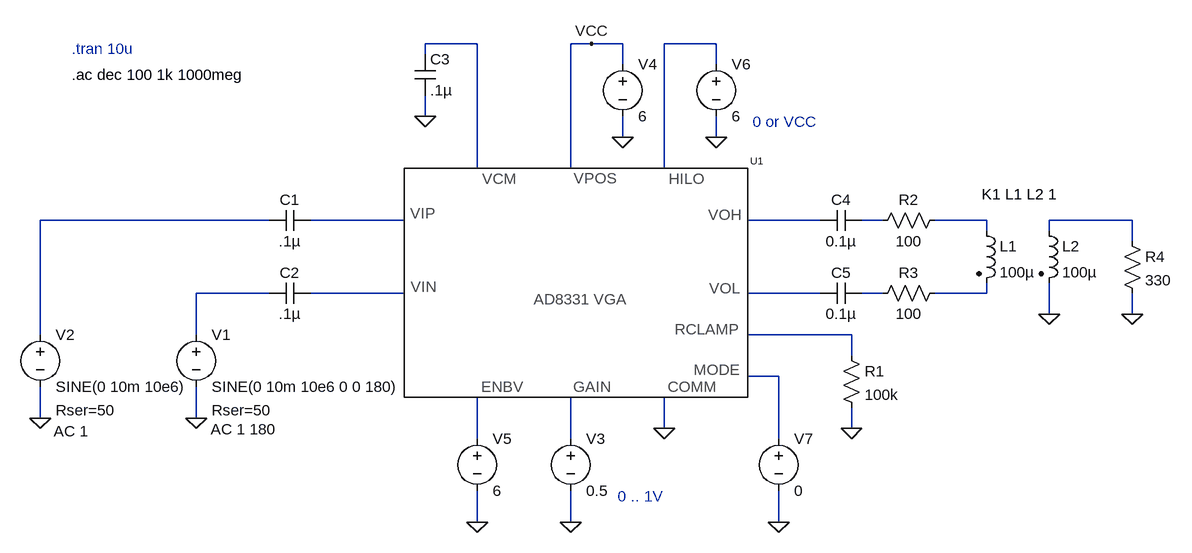
[diagram p0: schematic AD8331_VGA_test_ac.asc]
AD8331_VGA_test_ac.asc, the LTspice schematic file:
Version 4
SHEET 1 1140 680
WIRE 64 -176 -16 -176
WIRE 240 -176 208 -176
WIRE 288 -176 240 -176
WIRE 432 -176 352 -176
WIRE -16 -160 -16 -176
WIRE 288 -144 288 -176
WIRE 432 -144 432 -176
WIRE -16 -64 -16 -96
WIRE 288 -32 288 -64
WIRE 432 -32 432 -64
WIRE 64 16 64 -176
WIRE 208 16 208 -176
WIRE 352 16 352 -176
WIRE -256 96 -608 96
WIRE -48 96 -192 96
WIRE 592 96 480 96
WIRE 688 96 656 96
WIRE 848 96 768 96
WIRE 1072 96 944 96
WIRE 848 112 848 96
WIRE 944 112 944 96
WIRE 1072 128 1072 96
WIRE -256 208 -368 208
WIRE -48 208 -192 208
WIRE 592 208 480 208
WIRE 688 208 656 208
WIRE 848 208 848 192
WIRE 848 208 768 208
WIRE 944 240 944 192
WIRE 1072 240 1072 208
WIRE -608 272 -608 96
WIRE -368 272 -368 208
WIRE 640 272 480 272
WIRE 640 304 640 272
WIRE 528 336 480 336
WIRE -608 400 -608 352
WIRE -368 400 -368 352
WIRE 352 416 352 368
WIRE 640 416 640 384
WIRE 64 432 64 368
WIRE 208 432 208 368
WIRE 528 432 528 336
WIRE 64 560 64 512
WIRE 208 560 208 512
WIRE 528 560 528 512
FLAG -368 400 0
FLAG -608 400 0
FLAG 352 416 0
FLAG 208 560 0
FLAG 640 416 0
FLAG 288 -32 0
FLAG -16 -64 0
FLAG 944 240 0
FLAG 1072 240 0
FLAG 64 560 0
FLAG 528 560 0
FLAG 432 -32 0
FLAG 240 -176 VCC
SYMBOL cap -256 112 R270
WINDOW 0 32 32 VTop 0
WINDOW 3 0 32 VBottom 0
SYMATTR InstName C1
SYMATTR Value .1µ
SYMBOL cap -256 224 R270
WINDOW 0 32 32 VTop 0
WINDOW 3 0 32 VBottom 0
SYMATTR InstName C2
SYMATTR Value .1µ
SYMBOL voltage -368 256 R0
WINDOW 123 22 161 Left 0
WINDOW 39 24 132 Left 0
SYMATTR Value2 AC 1 180
SYMATTR SpiceLine Rser=50
SYMATTR InstName V1
SYMATTR Value SINE(0 10m 10e6 0 0 180)
SYMBOL voltage -608 256 R0
WINDOW 123 21 164 Left 0
WINDOW 39 24 132 Left 0
SYMATTR Value2 AC 1
SYMATTR SpiceLine Rser=50
SYMATTR InstName V2
SYMATTR Value SINE(0 10m 10e6)
SYMBOL voltage 208 416 R0
SYMATTR InstName V3
SYMATTR Value 0.5
SYMBOL res 624 288 R0
SYMATTR InstName R1
SYMATTR Value 100k
SYMBOL voltage 288 -160 R0
SYMATTR InstName V4
SYMATTR Value 6
SYMBOL cap -32 -160 R0
SYMATTR InstName C3
SYMATTR Value .1µ
SYMBOL cap 592 112 R270
WINDOW 0 32 32 VTop 0
WINDOW 3 0 32 VBottom 0
SYMATTR InstName C4
SYMATTR Value 0.1µ
SYMBOL cap 592 224 R270
WINDOW 0 32 32 VTop 0
WINDOW 3 0 32 VBottom 0
SYMATTR InstName C5
SYMATTR Value 0.1µ
SYMBOL res 672 112 R270
WINDOW 0 32 56 VTop 0
WINDOW 3 0 56 VBottom 0
SYMATTR InstName R2
SYMATTR Value 100
SYMBOL res 672 224 R270
WINDOW 0 32 56 VTop 0
WINDOW 3 0 56 VBottom 0
SYMATTR InstName R3
SYMATTR Value 100
SYMBOL ind2 832 96 R0
SYMATTR InstName L1
SYMATTR Value 100µ
SYMATTR Type ind
SYMBOL ind2 928 96 R0
SYMATTR InstName L2
SYMATTR Value 100µ
SYMATTR Type ind
SYMBOL res 1056 112 R0
SYMATTR InstName R4
SYMATTR Value 330
SYMBOL AD8331_VGA 64 176 R0
SYMATTR InstName U1
SYMBOL voltage 64 416 R0
SYMATTR InstName V5
SYMATTR Value 6
SYMBOL voltage 432 -160 R0
SYMATTR InstName V6
SYMATTR Value 6
SYMBOL voltage 528 416 R0
SYMATTR InstName V7
SYMATTR Value 0
TEXT 840 56 Left 0 !K1 L1 L2 1
TEXT -560 -168 Left 0 ;.tran 10u
TEXT 280 520 Left 0 ;0 .. 1V
TEXT 488 -56 Left 0 ;0 or VCC
TEXT -560 -128 Left 0 !.ac dec 100 1k 1000meg

The netlist it stands for:
* AD8331_VGA_test_ac.asc
C1 N003 N004 .1µ
C2 N009 N010 .1µ
V1 N009 0 SINE(0 10m 10e6 0 0 180) AC 1 180 Rser=50
V2 N003 0 SINE(0 10m 10e6) AC 1 Rser=50
V3 N017 0 0.5
R1 N014 0 100k
V4 VCC 0 6
C3 N001 0 .1µ
C4 N005 N006 0.1µ
C5 N011 N012 0.1µ
R2 N006 N007 100
R3 N012 N013 100
L1 N007 N013 100µ
L2 N008 0 100µ
R4 N008 0 330
XU1 N004 N010 N015 N017 N001 N014 N002 VCC N005 N011 0 N016 VGA  ; pins VIP VIN MODE GAIN VCM RCLAMP HILO VPOS VOH VOL COMM ENBV
V5 N016 0 6
V6 N002 0 6
V7 N015 0 0
K1 L1 L2 1
* .tran 10u
* 0 .. 1V
* 0 or VCC
.ac dec 100 1k 1000meg
.lib AD8331vga.cir
.backanno
.end